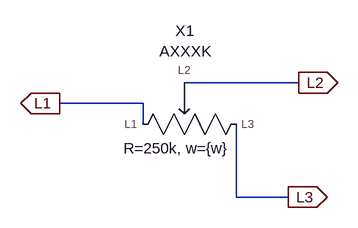
[diagram p0: schematic A250K.asc]
A250K.asc, the LTspice schematic file:
Version 4
SHEET 1 880 808
WIRE -224 480 -400 480
WIRE -464 512 -592 512
WIRE -464 544 -464 512
WIRE -320 656 -320 544
WIRE -240 656 -320 656
FLAG -224 480 L2
IOPIN -224 480 Out
FLAG -592 512 L1
IOPIN -592 512 Out
FLAG -240 656 L3
IOPIN -240 656 Out
SYMBOL Base_AxxxK -400 480 R0
WINDOW 39 -12 101 Center 2
SYMATTR InstName X1
SYMATTR SpiceLine R=250k, w={w}

The netlist it stands for:
* A250K.asc
XX1 L1 L2 L3 AXXXK R=250k, w={w}  ; pins L1 L2 L3
.backanno
.end